# EAGLE design CONTAINER (EAGLE 9.6.2)
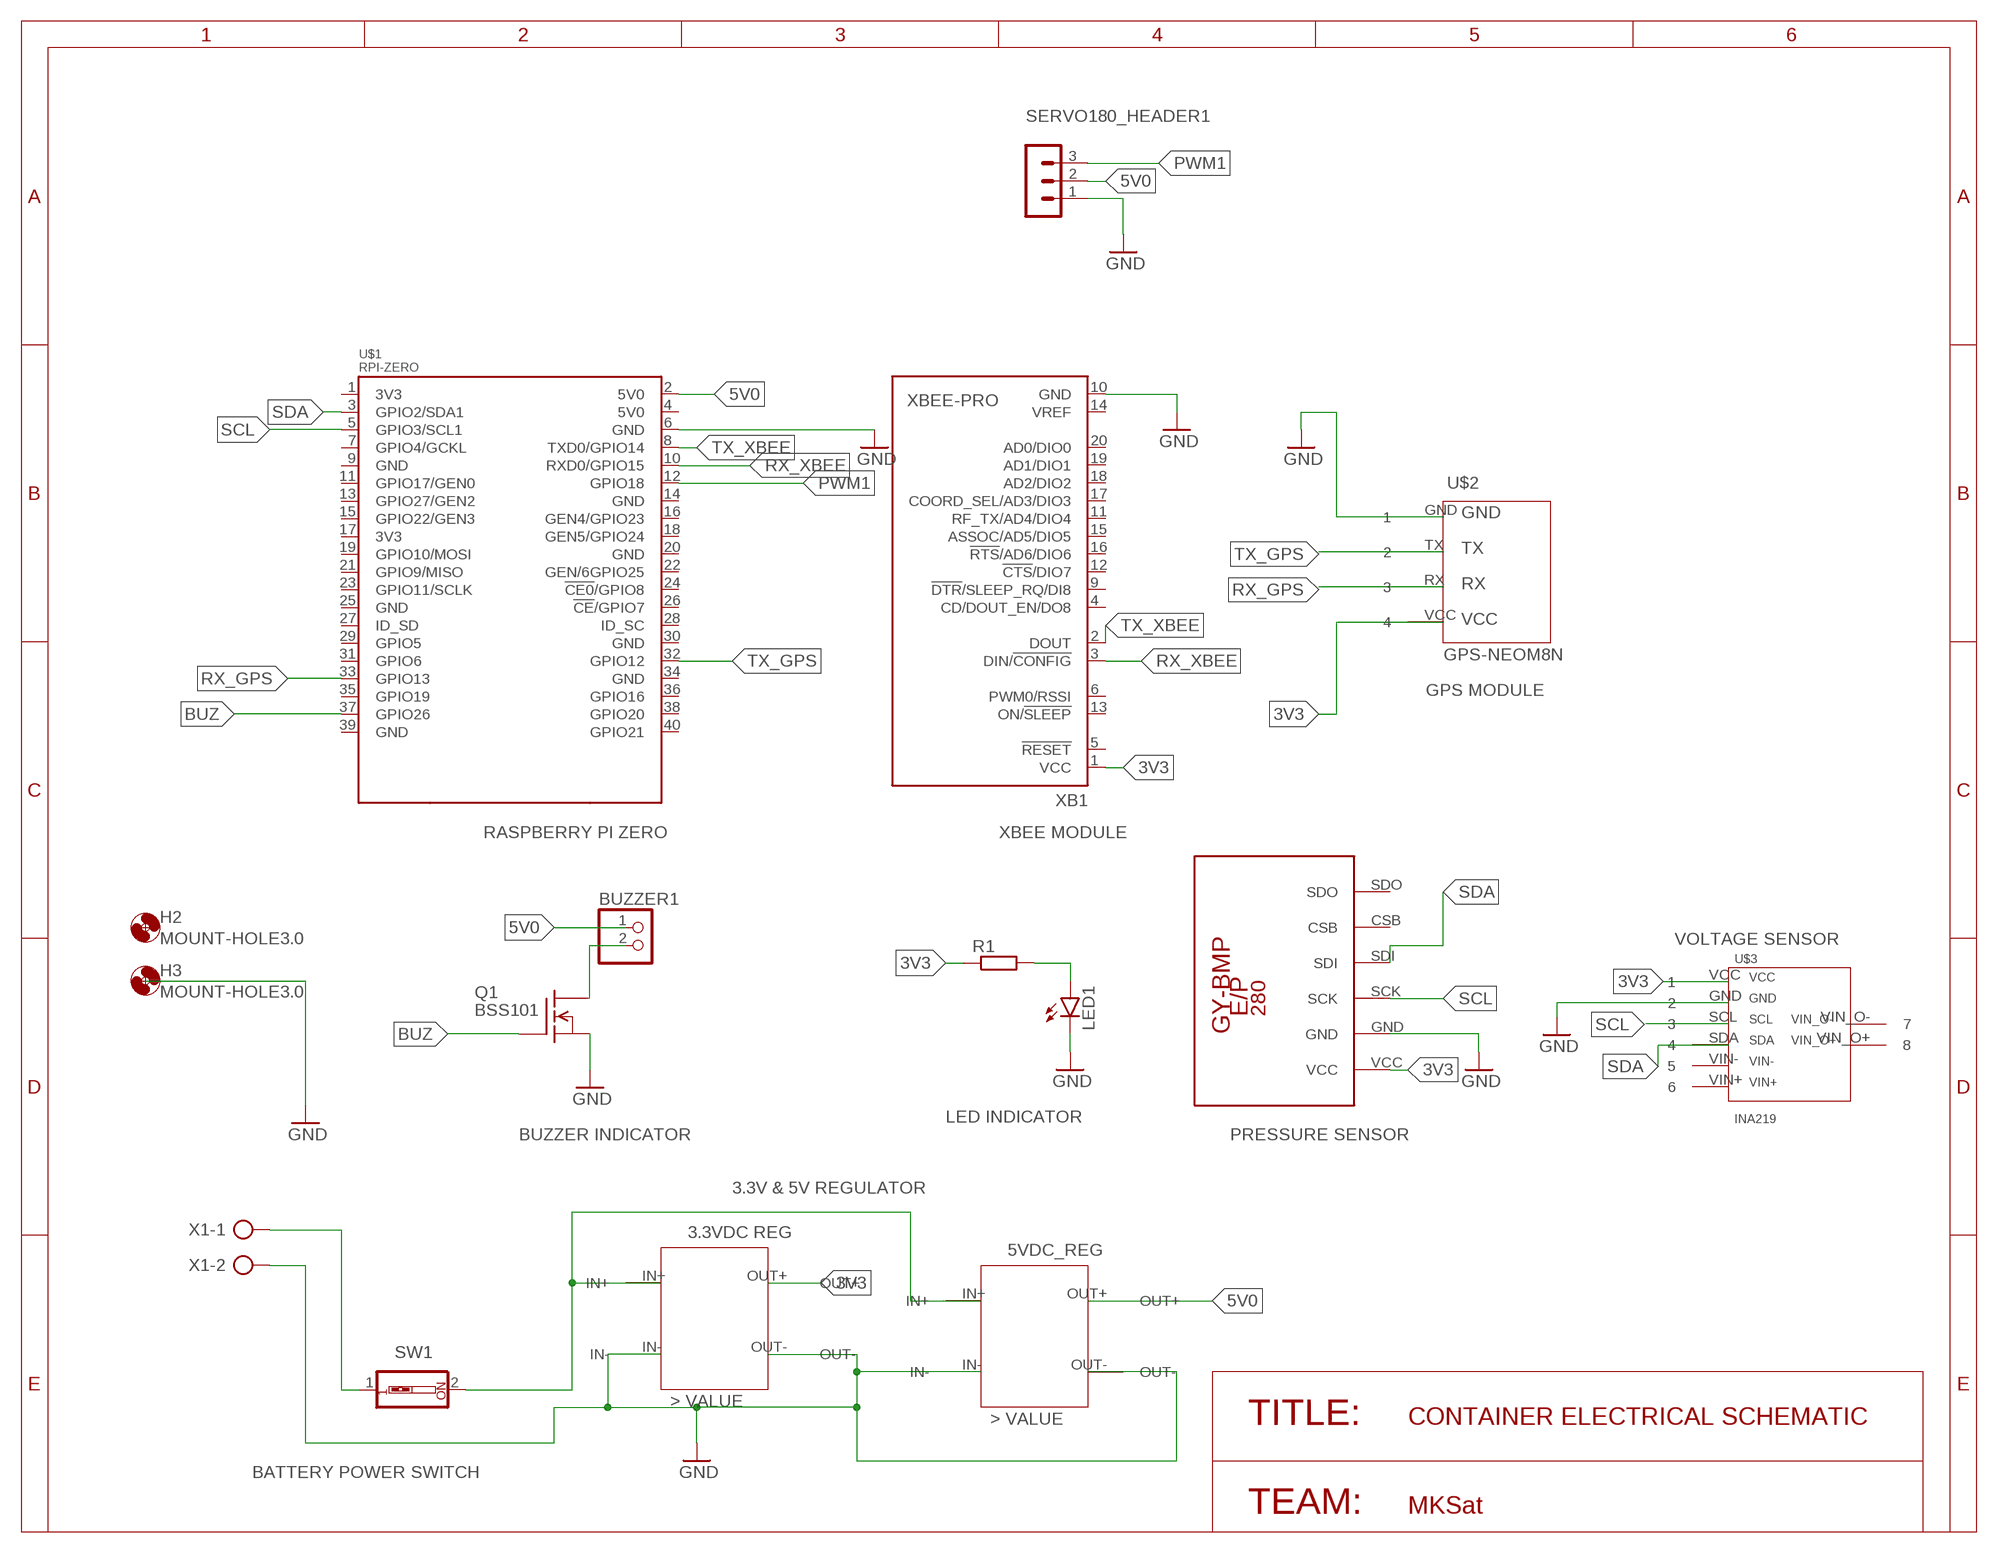
[diagram p0: schematic, sheet 1]

## Parts
BUZZER1  PINHD-1X2/90  [1X02/90]
H2  MOUNT-HOLE3.0  [3,0]
H3  MOUNT-HOLE3.0  [3,0]
LED1  LED5MM  [LED5MM]
Q1  BSS101  [TO92]
R1  R-EU_0207/12  [0207/12]
SERVO180_HEADER1  MA03-1  [MA03-1]
SW1  SW_DIP-1  [EDG-01]
U$1  RPI-ZERO  [RASPBERRYPI_BASTELSTUBE_V13_RASPI_BOARD_B+_FULL]
U$2  GPS-NEOM8N  [GPS_NEO_M8N]
U$3  INA219  [INA219_LIB]
U$4  GY-BPM280  [GY-BMP280-FOOTPRINT]
U$5  3VDC_REG  [3VDC_REG]
U$6  5VDC_REG  [5VDC_REG]
X1  AK500/2  [AK500/2]
XB1  XBEE-PRO  [XBEE-PRO]

## Nets
3V3: R1.1 U$2.VCC U$3.VCC U$4.VCC U$5.OUT+ XB1.1(VCC)
5V0: BUZZER1.1 SERVO180_HEADER1.2 U$1.2(5V0) U$6.OUT+
BUZ: Q1.2(G) U$1.37(GPIO26)
GND: LED1.K(C) Q1.1(S) SERVO180_HEADER1.1 U$1.6(GND) U$2.GND U$3.GND U$4.GND U$5.IN- U$5.OUT- U$6.IN- U$6.OUT- X1.2 XB1.10(GND)
N$5: LED1.A R1.2
N$6: SW1.1 X1.1
N$7: SW1.2 U$5.IN+ U$6.IN+
N$12: BUZZER1.2 Q1.3(D)
PWM1: SERVO180_HEADER1.3 U$1.12(GPIO18)
RX_GPS: U$1.33(GPIO13) U$2.RX
RX_XBEE: U$1.10(RXD0/GPIO15) XB1.3(DIN/!CONFIG)
SCL: U$1.5(GPIO3/SCL1) U$3.SCL U$4.SCK
SDA: U$1.3(GPIO2/SDA1) U$3.SDA U$4.SDI
TX_GPS: U$1.32(GPIO12) U$2.TX
TX_XBEE: U$1.8(TXD0/GPIO14) XB1.2(DOUT)
Unconnected: U$1.1(3V3) U$1.4(5V0) U$1.7(GPIO4/GCKL) U$1.9(GND) U$1.11(GPIO17/GEN0) U$1.13(GPIO27/GEN2) U$1.14(GND) U$1.15(GPIO22/GEN3) U$1.16(GEN4/GPIO23) U$1.17(3V3) U$1.18(GEN5/GPIO24) U$1.19(GPIO10/MOSI) U$1.20(GND) U$1.21(GPIO9/MISO) U$1.22(GEN/6GPIO25) U$1.23(GPIO11/SCLK) U$1.24(!CE0!/GPIO8) U$1.25(GND) U$1.26(!CE!/GPIO7) U$1.27(ID_SD) U$1.28(ID_SC) U$1.29(GPIO5) U$1.30(GND) U$1.31(GPIO6) U$1.34(GND) U$1.35(GPIO19) U$1.36(GPIO16) U$1.38(GPIO20) U$1.39(GND) U$1.40(GPIO21) U$3.VIN+ U$3.VIN- U$3.VIN_O+ U$3.VIN_O- U$4.CSB U$4.SDO XB1.4(CD/DOUT_EN/DO8) XB1.5(!RESET) XB1.6(PWM0/RSSI) XB1.9(!DTR!/SLEEP_RQ/DI8) XB1.11(RF_TX/AD4/DIO4) XB1.12(!CTS!/DIO7) XB1.13(ON/!SLEEP) XB1.14(VREF) XB1.15(ASSOC/AD5/DIO5) XB1.16(!RTS!/AD6/DIO6) XB1.17(COORD_SEL/AD3/DIO3) XB1.18(AD2/DIO2) XB1.19(AD1/DIO1) XB1.20(AD0/DIO0)

## Notes on the sheet
- GPS MODULE
- RASPBERRY PI ZERO | XBEE MODULE
- VOLTAGE SENSOR
- LED INDICATOR
- BUZZER INDICATOR | PRESSURE SENSOR
- 3.3V & 5V REGULATOR
- TITLE: | CONTAINER ELECTRICAL SCHEMATIC
- BATTERY POWER SWITCH
- TEAM: | MKSat

## Library data of the parts
BUZZER1 = pinhead:PINHD-1X2: PIN HEADER
H2 H3 = holes:MOUNT-HOLE: MOUNTING HOLE with drill center marker
LED1 = led:LED: LED OSRAM: - CHIPLED LG R971, LG N971, LY N971, LG Q971, LY Q971, LO R971, LY R971 LH N974, LH R974 LS Q976, LO Q976, LY Q976 LO Q996 - Hyper CHIPLED LW Q18S LB Q993, LB Q99A, LB R99A - SideLED LS A670, LO A670, LY A670, LG A670, LP A670 LB A673, LV A673, LT A673, LW A673 LH A674 LY A675 LS A676, LA A676, LO A676, LY A676, LW A676 LS A679, LY A679, LG A679 - Hyper Micro SIDELED® LS Y876, LA Y876, LO Y876, LY Y876 LT Y87S - SmartLED LW L88C, LW L88S LB L89C, LB L89S, LG L890 LS L89K, LO L89K, LY L89K LS L896, LA L896, LO L896, LY L896 - TOPLED LS T670, LO T670, LY T670, LG T670, LP T670 LSG T670, LSP T670, LSY T670, LOP T670, LYG T670 LG T671, LOG T671, LSG T671 LB T673, LV T673, LT T673, LW T673 LH T674 LS T676, LA T676, LO T676, LY T676, LB T676, LH T676, LSB T676, LW T676 LB T67C, LV T67C, LT T67C, LS T67K, LO T67K, LY T67K, LW E67C LS E67B, LA E67B, LO E67B, LY E67B, LB E67C, LV E67C, LT E67C LW T67C LS T679, LY T679, LG T679 LS T770, LO T770, LY T770, LG T770, LP T770 LB T773, LV T773, LT T773, LW T773 LH T774 LS E675, LA E675, LY E675, LS T675 LS T776, LA T776, LO T776, LY T776, LB T776 LHGB T686 LT T68C, LB T68C - Hyper Mini TOPLED® LB M676 - Mini TOPLED Santana® LG M470 LS M47K, LO M47K, LY M47K Source: http://www.osram.convergy.de LUXEON: - LUMILED® LXK2-PW12-R00, LXK2-PW12-S00, LXK2-PW14-U00, LXK2-PW14-V00 LXK2-PM12-R00, LXK2-PM12-S00, LXK2-PM14-U00 LXK2-PE12-Q00, LXK2-PE12-R00, LXK2-PE12-S00, LXK2-PE14-T00, LXK2-PE14-U00 LXK2-PB12-K00, LXK2-PB12-L00, LXK2-PB12-M00, LXK2-PB14-N00, LXK2-PB14-P00, LXK2-PB14-Q00 LXK2-PR12-L00, LXK2-PR12-M00, LXK2-PR14-Q00, LXK2-PR14-R00 LXK2-PD12-Q00, LXK2-PD12-R00, LXK2-PD12-S00 LXK2-PH12-R00, LXK2-PH12-S00 LXK2-PL12-P00, LXK2-PL12-Q00, LXK2-PL12-R00 Source: www.luxeon.com KINGBRIGHT: KA-3528ASYC Source: www.kingbright.com
Q1 = transistor-fet:BSS101: N-Channel Enhancement MOSFET 200V; 0,16A; 11Ohm
R1 = rcl:R-EU_: RESISTOR, European symbol; SPICEPREFIX: R
SERVO180_HEADER1 = con-lstb:MA03-1: PIN HEADER; OC_FARNELL: unknown; OC_NEWARK: unknown
SW1 = special:SW_DIP-1: DIP SWITCH
U$1 = RPI-Zero:RPI-ZERO
U$2 = GPS NEO M8N:GPS-NEOM8N
U$3 = INA219_LIB:INA219
U$4 = GY-BMP280:GY-BPM280
U$5 = VOLTAGE_REGULATORS_CANSAT:3VDC_REG
U$6 = VOLTAGE_REGULATORS_CANSAT:5VDC_REG
X1 = con-ptr500:AK500/2: CONNECTOR; OC_FARNELL: unknown; OC_NEWARK: unknown
XB1 = maxstream:XBEE: XBee (TM) /XBee-PRO(TM) OEM RF Modules Source: MaxStream, Inc. xbee_productmanual.pdf; MPN: XBP24-AWI-001; OC_FARNELL: 1337916; OC_NEWARK: 42M2667

## Board
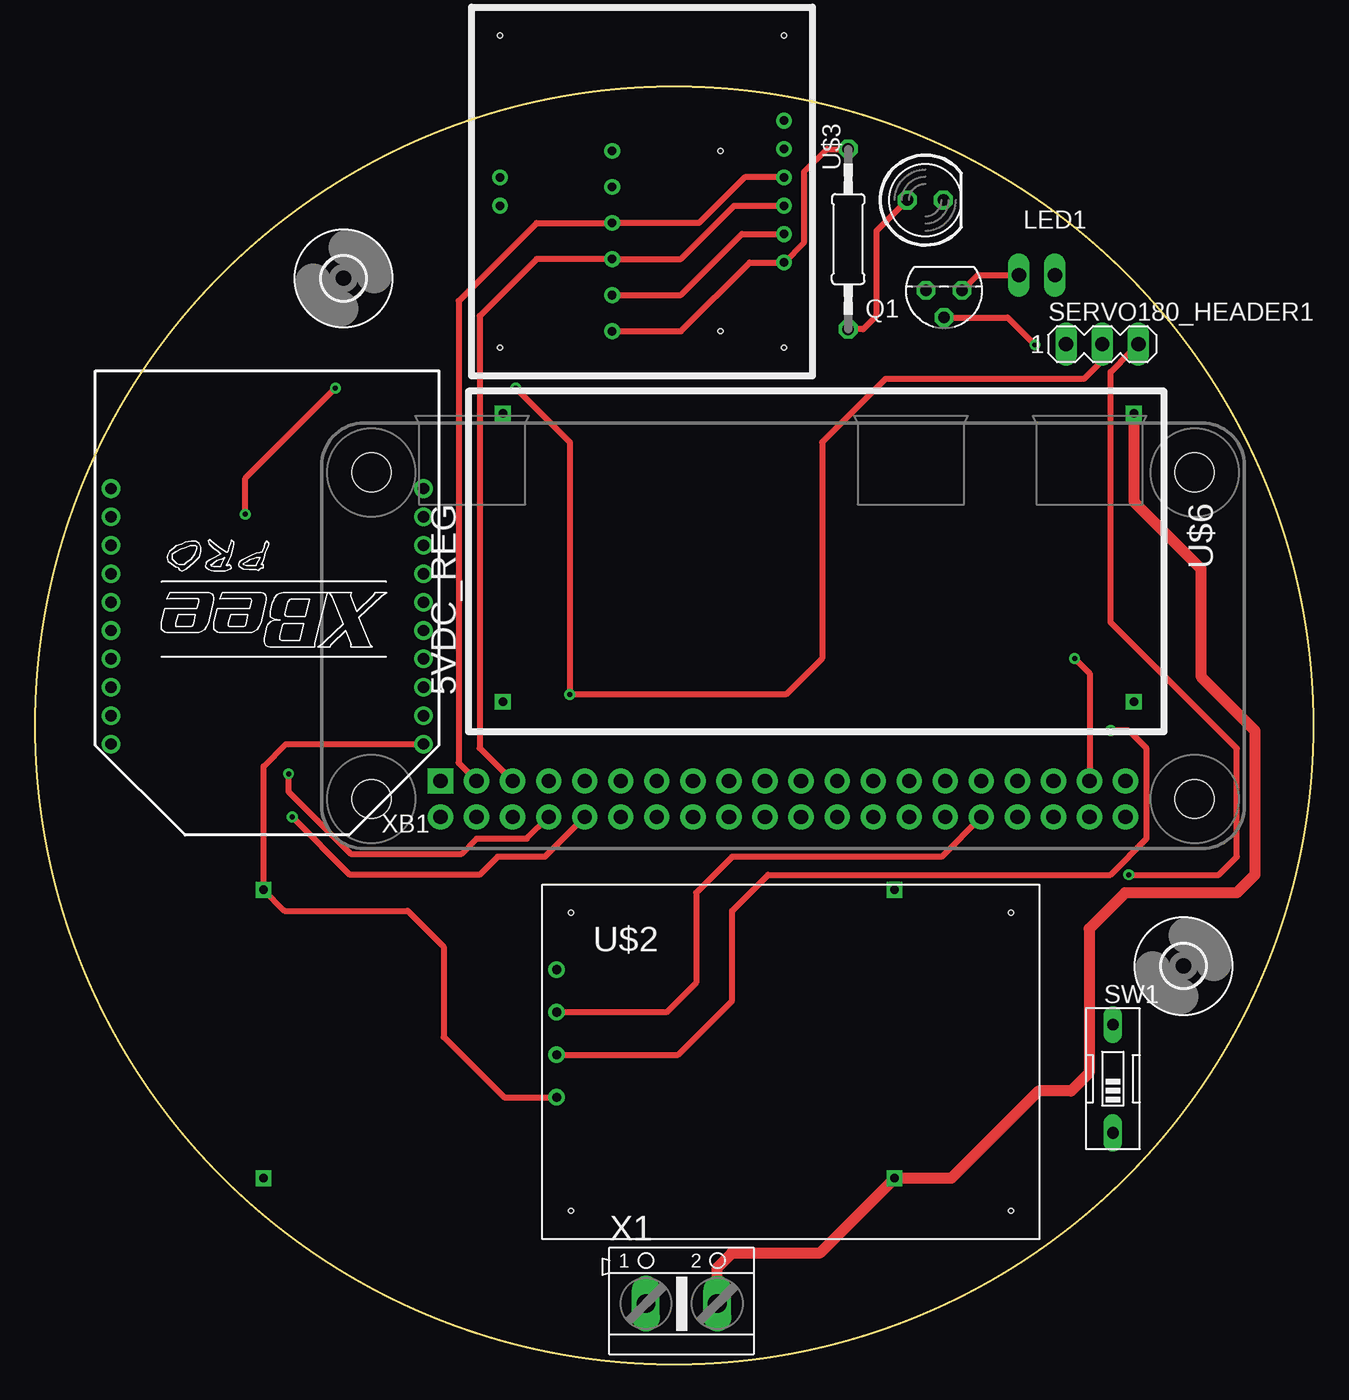
[diagram p1: board, top side]
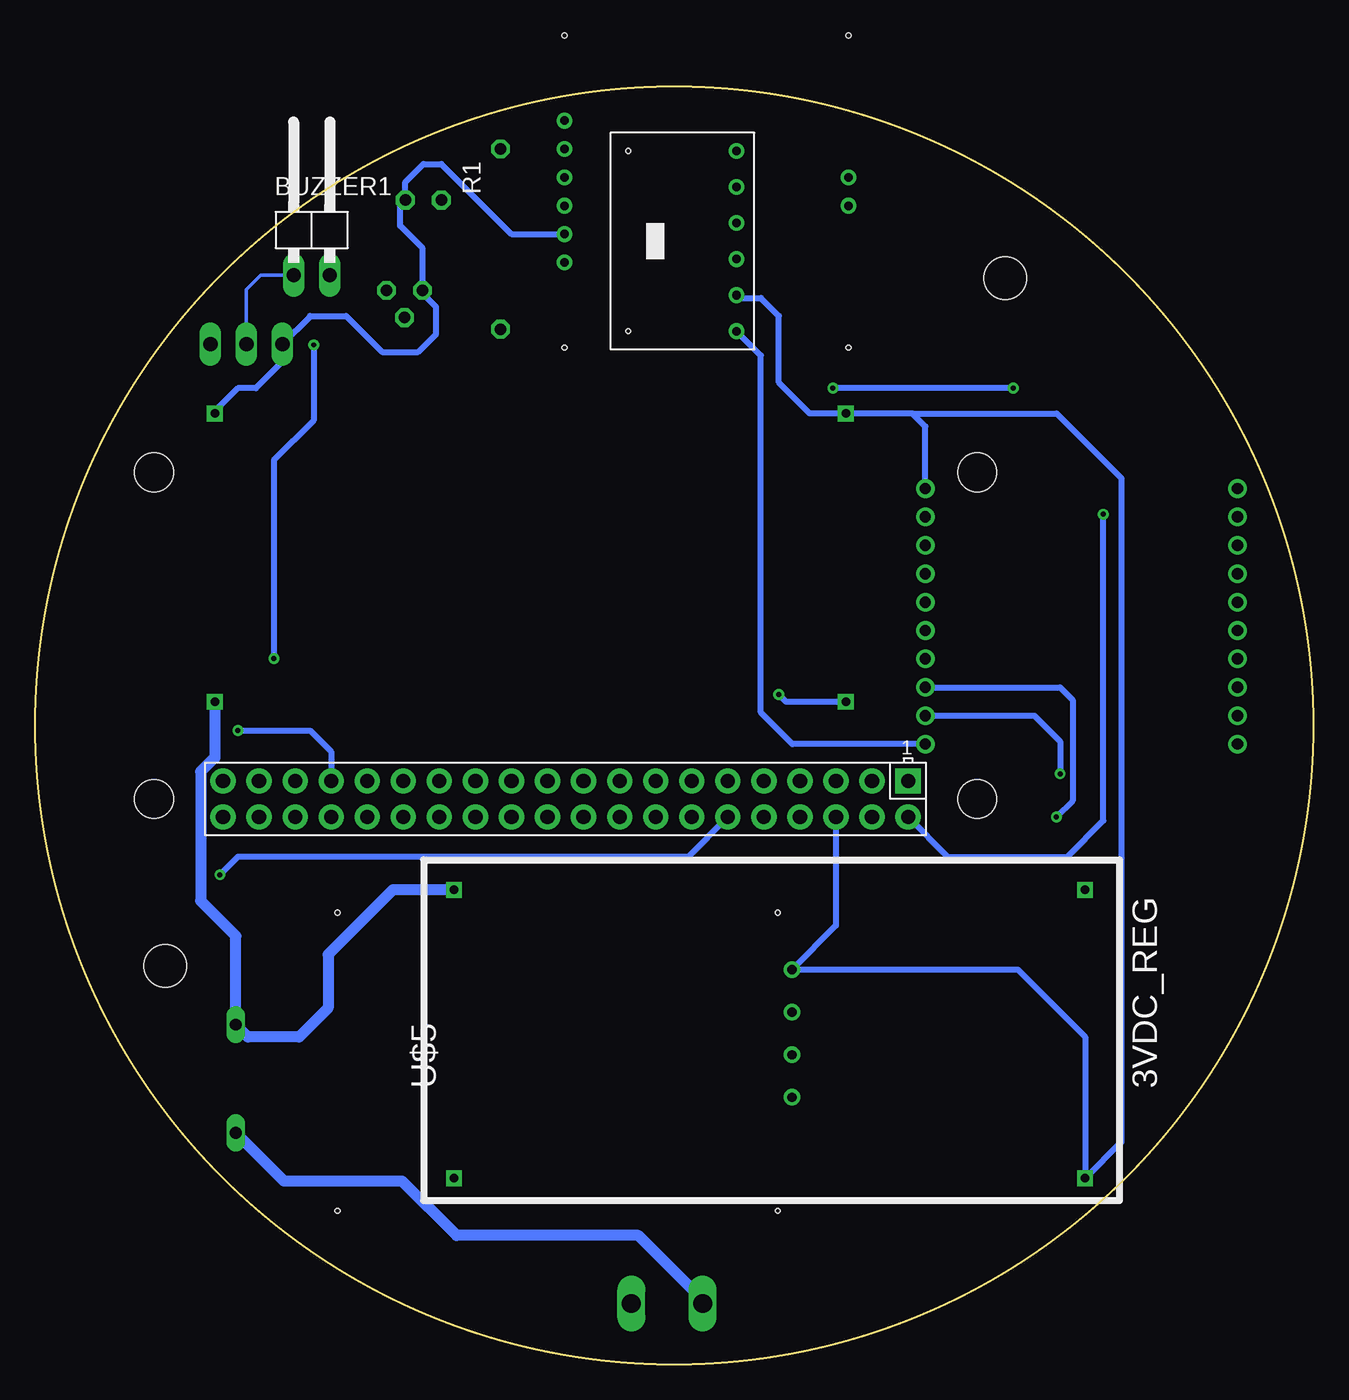
[diagram p2: board, bottom side, seen from below]

Size 90 x 90 mm. Coordinates in mm from the lower left corner, seen from the top.
Outline: circle at 45,45 radius 45
Copper layers (1*16): Top 0.035mm / dielectric 1.5mm / Bottom 0.035mm
Design rules "default *": minimum track width 6mil, minimum drill 0.35mm, track to track 12mil, track to pad 12mil, pad to pad 12mil, via to via 12mil, smd to smd 12mil, copper to edge 40mil, drill to drill 6mil, minimum pad ring 10mil, minimum via ring 8mil, stop-mask expansion 4mil, vias tented up to drill 0mil, thermal gap 10mil

### Footprints (pad centres in the part's own frame; a part is rotated, then mirrored left to right if it is on the bottom)
1X02/90 = drill 1.016 long: 1 -1.27,-3.81; 2 1.27,-3.81
3,0 = hole 3: 0,0
LED5MM = drill 0.813 octagon: A -1.27,0; K 1.27,0
TO92 = drill 0.813 octagon: 1 1.27,0; 2 0,1.905; 3 -1.27,0
0207/12 = drill 0.813 octagon: 1 -6.35,0; 2 6.35,0
MA03-1 = drill 1.016 long: 1 -2.54,0; 2 0,0; 3 2.54,0
EDG-01 = drill 0.813 long: 1 0,-3.81; 2 0,3.81
RASPBERRYPI_BASTELSTUBE_V13_RASPI_BOARD_B+_FULL = drill 1 pad 1.778 square: 1 8.37,25.23 | drill 1 pad 1.778: 2 8.37,27.77; 3 10.91,25.23; 4 10.91,27.77; 5 13.45,25.23; 6 13.45,27.77; 7 15.99,25.23; 8 15.99,27.77; 9 18.53,25.23; 10 18.53,27.77; 11 21.07,25.23; 12 21.07,27.77; 13 23.61,25.23; 14 23.61,27.77; 15 26.15,25.23; 16 26.15,27.77; 17 28.69,25.23; 18 28.69,27.77; 19 31.23,25.23; 20 31.23,27.77; 21 33.77,25.23; 22 33.77,27.77; 23 36.31,25.23; 24 36.31,27.77; 25 38.85,25.23; 26 38.85,27.77; 27 41.39,25.23; 28 41.39,27.77; 29 43.93,25.23; 30 43.93,27.77; 31 46.47,25.23; 32 46.47,27.77; 33 49.01,25.23; 34 49.01,27.77; 35 51.55,25.23; 36 51.55,27.77; 37 54.09,25.23; 38 54.09,27.77; 39 56.63,25.23; 40 56.63,27.77 | hole 2.75: 3.5,3.5; 3.5,26.5; 61.5,3.5; 61.5,26.5
GPS_NEO_M8N = drill 0.65: GND -15.27,6.54; RX -15.27,0.54; TX -15.27,3.54; VCC -15.27,-2.46 | hole 0.35: -14.27,10.54; 16.73,10.54; -14.27,-10.46; 16.73,-10.46
INA219_LIB = drill 0.6: GND -10,4; SCL -10,2; SDA -10,0; VCC -10,6; VIN+ -10,-4; VIN- -10,-2; VIN_O+ 10,0; VIN_O- 10,2 | hole 0.35: -10,12; 10,12; -10,-10; 10,-10
GY-BMP280-FOOTPRINT = drill 0.6: CSB 11.43,0; GND 3.81,0; SCK 6.35,0; SDI 8.89,0; SDO 13.97,0; VCC 1.27,0 | hole 0.35: 1.27,7.62; 13.97,7.62
3VDC_REG = drill 0.6 square: IN+ -22.86,8.89; IN- -22.86,-11.43; OUT+ 21.59,8.89; OUT- 21.59,-11.43
5VDC_REG = drill 0.6 square: IN+ -22.86,8.89; IN- -22.86,-11.43; OUT+ 21.59,8.89; OUT- 21.59,-11.43
AK500/2 = drill 1.321 long: 1 -2.515,0; 2 2.515,0
XBEE-PRO = drill 0.8 pad 1.27: 1 -11,9; 2 -11,7; 3 -11,5; 4 -11,3; 5 -11,1; 6 -11,-1; 7 -11,-3; 8 -11,-5; 9 -11,-7; 10 -11,-9; 11 11,-9; 12 11,-7; 13 11,-5; 14 11,-3; 15 11,-1; 16 11,1; 17 11,3; 18 11,5; 19 11,7; 20 11,9

### Placement (x,y rotation side)
BUZZER1  70.54,80.54 0 bottom
H2  21.7,76.51 0 top
H3  80.87,28.05 0 top
LED1  62.68,82.02 0 top
Q1  64,75.65 180 top
R1  57.25,79.27 270 top
SERVO180_HEADER1  75.15,71.87 0 top
SW1  75.89,20.1 0 top
U$1  20.16,66.32 180 bottom
U$2  51.98,21.25 0 top
U$3  42.73,83.62 180 top
U$4  40.62,71.51 90 bottom
U$5  37.65,24.52 0 bottom
U$6  54.51,55.55 180 top
X1  45.51,4.25 0 top
XB1  16.32,52.69 180 top

### Tracks (layer width: path | path; a pad name or v marks a point on that pad's centre or on a via)
3V3
  Top 0.406: XB1.1 17.64,43.69 16.06,42.11 U$5.OUT+ 17.53,31.94 26.21,31.94 28.75,29.4 28.75,23.05 33.01,18.79 U$2.VCC | R1.1 55.76,85.62 54.15,84.01 54.15,79.04 U$3.VCC 50.3,77.62 45.46,72.78 U$4.VCC
  Bottom 0.406: U$4.VCC 38.91,71.07 38.91,45.91 36.69,43.69 XB1.1
5V0  (via drill 0.35)
  Top 0.406: SERVO180_HEADER1.2 75.15,70.72 73.83,69.41 59.87,69.41 55.42,64.96 55.42,49.72 52.88,47.18 v37.64,47.18 37.64,64.96 v33.83,68.77 | v14.78,59.88 14.78,62.42 v21.13,68.77
  Bottom 0.254: SERVO180_HEADER1.2 75.15,75.71 74.13,76.73 BUZZER1.1
  Bottom 0.406: U$6.OUT+ 37.12,46.66 v37.64,47.18 | U$1.2 25.73,35.75 17.32,35.75 14.78,38.29 v14.78,59.88 | v21.13,68.77 v33.83,68.77
BUZ  (via drill 0.35)
  Top 0.406: v73.2,49.72 74.25,48.67 U$1.37 | Q1.2 68.48,73.75 v70.41,71.82
  Bottom 0.406: v70.41,71.82 70.41,66.48 73.2,63.69 v73.2,49.72
GND
  Top 0.406: U$4.GND 45.46,75.32 49.76,79.62 U$3.GND
  Top 0.762: U$6.IN- 77.37,60.79 82.09,56.07 82.09,48.45 85.9,44.64 85.9,34.48 84.63,33.21 76.76,33.21 74.22,30.67 74.22,20.51 72.95,19.24 70.66,19.24 64.51,13.09 U$5.IN- 55.23,7.81 49.05,7.81 48.03,6.79 X1.2
  Bottom 0.406: XB1.10 27.32,66.07 28.23,66.98 | 28.23,66.98 U$6.OUT- 35.46,66.98 37.64,69.16 37.64,73.85 38.91,75.12 40.42,75.12 U$4.GND | U$3.GND 56.47,79.62 61.41,84.56 62.68,84.56 63.95,83.29 LED1.K 64.31,81.66 64.31,80.2 62.73,78.62 Q1.1 62.83,75.55 61.77,74.49 61.77,72.58 63.04,71.31 65.58,71.31 68.12,73.85 70.66,73.85 70.66,73.82 SERVO180_HEADER1.1 72.61,70.63 74.47,68.77 75.74,68.77 77.37,67.14 U$6.IN- | U$1.6 33.61,30.89 U$2.GND 20.79,27.79 16.06,23.06 U$5.OUT- 13.51,15.64 13.51,62.42 18.07,66.98 28.23,66.98
N$5
  Top 0.406: LED1.A 59.23,79.84 59.23,73.85 58.3,72.92 R1.2
N$6
  Bottom 0.762: SW1.1 72.49,12.89 64.17,12.89 60.33,9.06 47.52,9.06 43,4.53 X1.1
N$7
  Bottom 0.762: U$6.IN+ 77.37,42.74 78.36,41.74 78.36,32.64 75.89,30.16 SW1.2 75.03,23.05 71.42,23.05 69.39,25.08 69.39,28.85 64.83,33.41 U$5.IN+
N$12
  Top 0.406: Q1.3 66.35,76.73 BUZZER1.2
PWM1  (via drill 0.35)
  Top 0.406: v77.01,34.48 83.36,34.48 84.63,35.75 84.63,43.37 75.74,52.26 75.74,69.91 76.42,70.58 76.42,70.6 SERVO180_HEADER1.3
  Bottom 0.406: U$1.12 44.03,35.75 75.74,35.75 v77.01,34.48
RX_GPS  (via drill 0.35)
  Top 0.406: U$2.RX 45.27,21.79 49.07,25.59 49.07,31.94 51.61,34.48 75.74,34.48 78.28,37.02 78.28,43.37 77.01,44.64 v75.74,44.64
  Bottom 0.406: v75.74,44.64 70.66,44.64 69.17,43.15 U$1.33
RX_XBEE  (via drill 0.35)
  Top 0.406: U$1.10 35.89,35.75 32.56,35.75 31.29,34.48 22.15,34.48 v18.08,38.54
  Bottom 0.406: XB1.3 17.83,47.69 16.94,46.8 16.94,39.68 v18.08,38.54
SCL
  Top 0.406: U$3.SCL 49.22,81.62 45.46,77.86 U$4.SCK 35.3,77.86 31.29,73.85 31.29,43.41 U$1.5
SDA
  Top 0.406: U$1.3 29.8,42.36 29.8,74.9 35.3,80.4 U$4.SDI 46.73,80.4 49.95,83.62 U$3.SDA
TX_GPS
  Top 0.406: U$1.32 63.83,35.75 49.07,35.75 46.53,33.21 46.53,26.86 44.46,24.79 U$2.TX
TX_XBEE  (via drill 0.35)
  Top 0.406: v17.83,41.59 17.83,40.32 22.19,35.96 30.02,35.96 31.08,37.02 34.62,37.02 U$1.8
  Bottom 0.406: XB1.2 19.64,45.69 17.83,43.88 v17.83,41.59

### Text on the board
Text: INA-219 | BMP-280